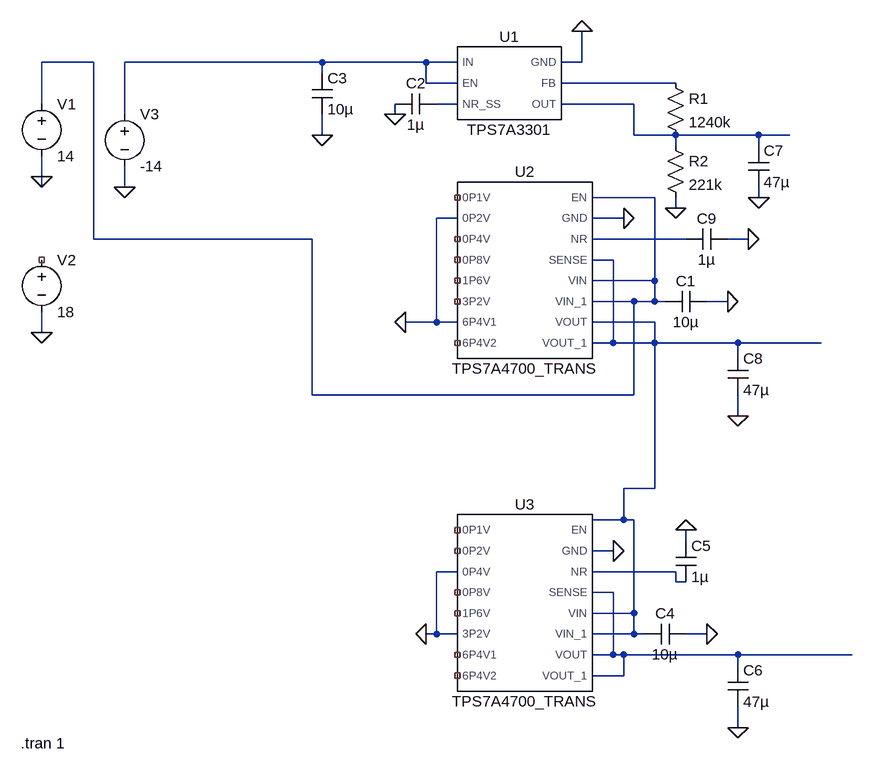
[diagram p0: schematic Питание.asc]
Питание.asc, the LTspice schematic file:
Version 4.1
SHEET 1 880 1176
WIRE -496 112 -576 112
WIRE -144 112 -448 112
WIRE 16 112 -144 112
WIRE 64 112 16 112
WIRE 256 112 256 64
WIRE 256 112 224 112
WIRE -144 128 -144 112
WIRE 16 144 16 112
WIRE 64 144 16 144
WIRE 400 144 224 144
WIRE -576 176 -576 112
WIRE 64 176 32 176
WIRE 336 176 224 176
WIRE -448 192 -448 112
WIRE -32 192 -32 176
WIRE -144 224 -144 192
WIRE 336 224 336 176
WIRE 400 224 336 224
WIRE 528 224 400 224
WIRE 576 224 528 224
WIRE 400 240 400 224
WIRE 528 240 528 224
WIRE -576 288 -576 256
WIRE -576 304 -576 288
WIRE -448 304 -448 272
WIRE 368 320 272 320
WIRE 528 320 528 304
WIRE 400 336 400 320
WIRE 64 352 32 352
WIRE 320 352 272 352
WIRE -496 384 -496 112
WIRE -160 384 -496 384
WIRE 416 384 272 384
WIRE 512 384 480 384
WIRE 304 416 272 416
WIRE 368 448 368 320
WIRE 368 448 272 448
WIRE 336 480 272 480
WIRE 368 480 368 448
WIRE 368 480 336 480
WIRE 384 480 368 480
WIRE 480 480 448 480
WIRE 32 512 32 352
WIRE 32 512 -16 512
WIRE 64 512 32 512
WIRE 368 512 272 512
WIRE -576 528 -576 496
WIRE 304 544 304 416
WIRE 304 544 272 544
WIRE 368 544 368 512
WIRE 368 544 304 544
WIRE 496 544 368 544
WIRE 624 544 496 544
WIRE 496 560 496 544
WIRE -160 624 -160 384
WIRE 336 624 336 480
WIRE 336 624 -160 624
WIRE 496 656 496 624
WIRE 368 768 368 544
WIRE 368 768 320 768
WIRE 320 816 320 768
WIRE 320 816 272 816
WIRE 336 816 320 816
WIRE 272 832 272 816
WIRE 416 848 416 832
WIRE 304 864 272 864
WIRE 64 896 32 896
WIRE 400 896 272 896
WIRE 400 912 400 896
WIRE 416 912 400 912
WIRE 304 928 272 928
WIRE 336 960 336 816
WIRE 336 960 272 960
WIRE 32 992 32 896
WIRE 32 992 16 992
WIRE 64 992 32 992
WIRE 336 992 336 960
WIRE 336 992 272 992
WIRE 352 992 336 992
WIRE 448 992 416 992
WIRE 304 1024 304 928
WIRE 304 1024 272 1024
WIRE 320 1024 304 1024
WIRE 496 1024 320 1024
WIRE 672 1024 496 1024
WIRE 496 1040 496 1024
WIRE 320 1056 320 1024
WIRE 320 1056 272 1056
WIRE 496 1136 496 1104
FLAG -576 288 0
FLAG -576 528 0
FLAG -448 304 0
FLAG 256 64 0
FLAG 320 352 0
FLAG -16 512 0
FLAG 16 992 0
FLAG 304 864 0
FLAG 480 480 0
FLAG -32 192 0
FLAG -144 224 0
FLAG 400 336 0
FLAG 448 992 0
FLAG 416 832 0
FLAG 496 1136 0
FLAG 528 320 0
FLAG 496 656 0
FLAG 512 384 0
SYMBOL TPS7A3301 144 144 R0
SYMATTR InstName U1
SYMBOL TPS7A4700_TRANS 160 432 R0
SYMATTR InstName U2
SYMBOL TPS7A4700_TRANS 160 944 R0
SYMATTR InstName U3
SYMBOL voltage -576 160 R0
WINDOW 123 0 0 Left 0
WINDOW 39 0 0 Left 0
SYMATTR InstName V1
SYMATTR Value 14
SYMBOL voltage -576 400 R0
WINDOW 123 0 0 Left 0
WINDOW 39 0 0 Left 0
SYMATTR InstName V2
SYMATTR Value 18
SYMBOL voltage -448 176 R0
WINDOW 123 0 0 Left 0
WINDOW 39 0 0 Left 0
SYMATTR InstName V3
SYMATTR Value -14
SYMBOL cap 448 464 R90
WINDOW 0 0 32 VBottom 2
WINDOW 3 32 32 VTop 2
SYMATTR InstName C1
SYMATTR Value 10µ
SYMBOL cap 32 160 R90
WINDOW 0 0 32 VBottom 2
WINDOW 3 32 32 VTop 2
SYMATTR InstName C2
SYMATTR Value 1µ
SYMBOL cap -160 128 R0
SYMATTR InstName C3
SYMATTR Value 10µ
SYMBOL res 384 128 R0
SYMATTR InstName R1
SYMATTR Value 1240k
SYMBOL res 384 224 R0
SYMATTR InstName R2
SYMATTR Value 221k
SYMBOL cap 416 976 R90
WINDOW 0 0 32 VBottom 2
WINDOW 3 32 32 VTop 2
SYMATTR InstName C4
SYMATTR Value 10µ
SYMBOL cap 400 848 R0
SYMATTR InstName C5
SYMATTR Value 1µ
SYMBOL cap 480 1040 R0
SYMATTR InstName C6
SYMATTR Value 47µ
SYMBOL cap 512 240 R0
SYMATTR InstName C7
SYMATTR Value 47µ
SYMBOL cap 480 560 R0
SYMATTR InstName C8
SYMATTR Value 47µ
SYMBOL cap 480 368 R90
WINDOW 0 0 32 VBottom 2
WINDOW 3 32 32 VTop 2
SYMATTR InstName C9
SYMATTR Value 1µ
TEXT -608 1160 Left 2 !.tran 1

The netlist it stands for:
* Питание.asc
X§U1 N002 N002 N004 0 N003 N005 TPS7A3301  ; pins IN EN NR_SS GND FB OUT
X§U2 NC_01 0 NC_02 NC_03 NC_04 NC_05 0 NC_06 N001 0 N006 N007 N001 N001 N007 N007 TPS7A4700_TRANS  ; pins 0P1V 0P2V 0P4V 0P8V 1P6V 3P2V 6P4V1 6P4V2 EN GND NR SENSE VIN VIN_1 VOUT VOUT_1
X§U3 NC_07 NC_08 0 NC_09 NC_10 0 NC_11 NC_12 N007 0 N008 N009 N007 N007 N009 N009 TPS7A4700_TRANS  ; pins 0P1V 0P2V 0P4V 0P8V 1P6V 3P2V 6P4V1 6P4V2 EN GND NR SENSE VIN VIN_1 VOUT VOUT_1
V1 N001 0 14
V2 NC_13 0 18
V3 N002 0 -14
C1 0 N001 10µ
C2 N004 0 1µ
C3 N002 0 10µ
R1 N003 N005 1240k
R2 N005 0 221k
C4 0 N007 10µ
C5 0 N008 1µ
C6 N009 0 47µ
C7 N005 0 47µ
C8 N007 0 47µ
C9 0 N006 1µ
.tran 1
.lib C:\Users\User\Documents\LTspice\TPS7A3301.lib
.lib C:\Users\User\Documents\LTspice\TPS7A4700_TRANS.LIB
.backanno
.end